# Altium project slave-14-mc33775.PrjPcb (part 2 of 2)
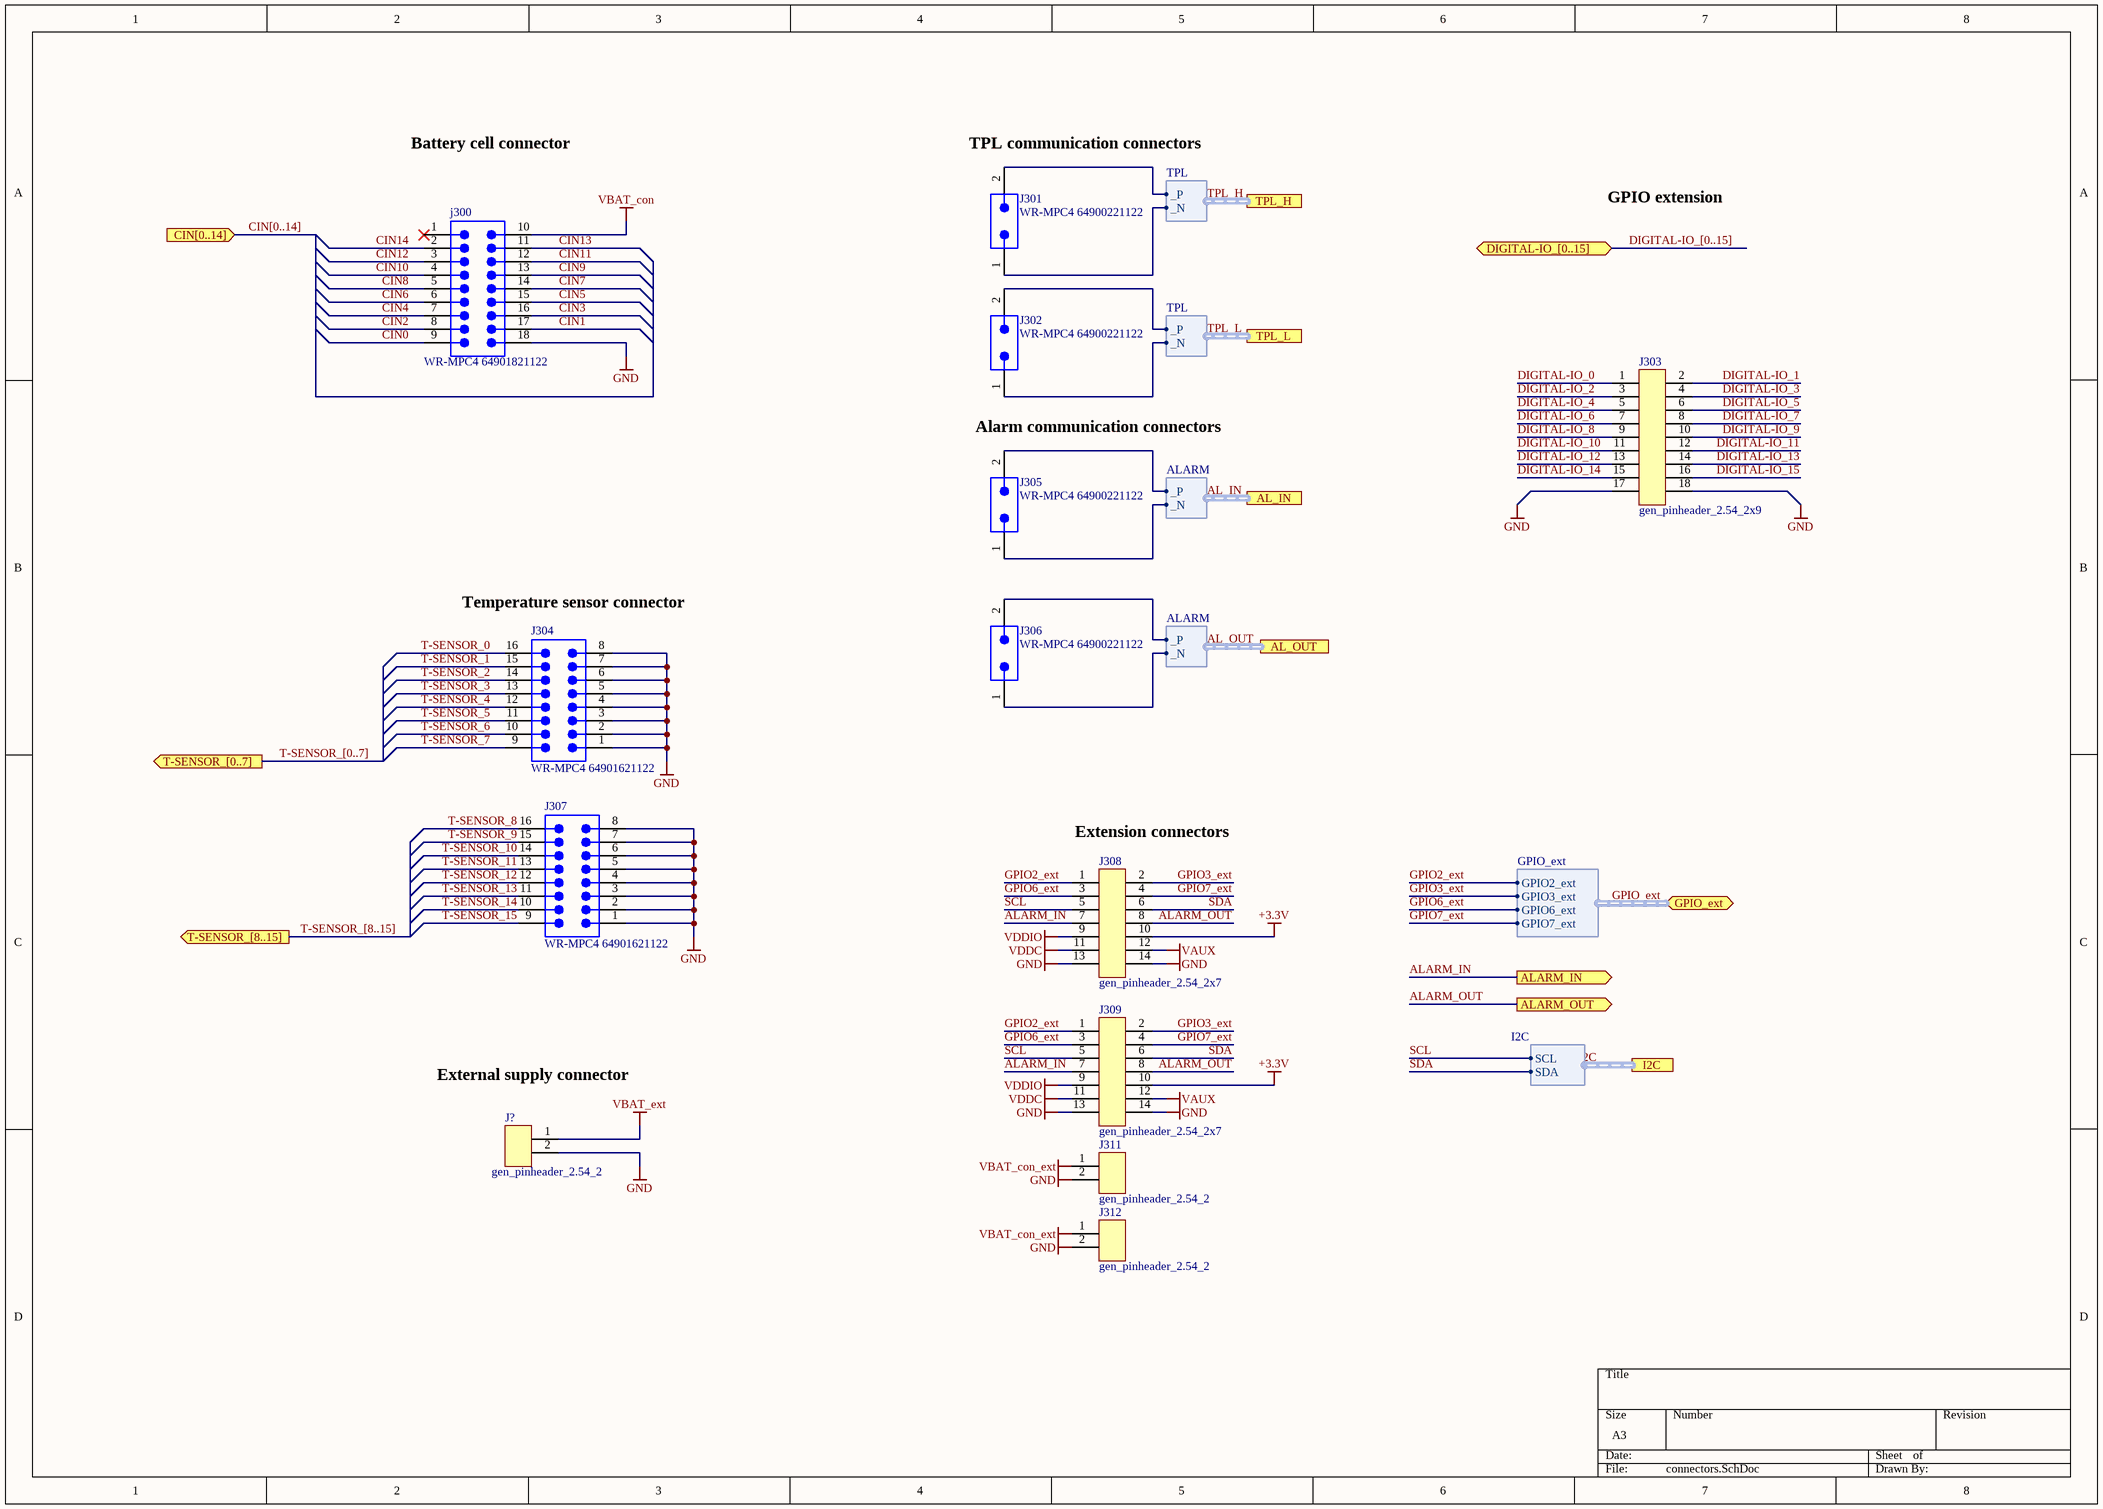
[diagram p8: connectors.SchDoc]

## Assembly variants
foxBMS_14cell_BMS-Slave_NXP775A_minimal: not fitted ALARM_IN C200_1 C200_2 C201_1 C201_2 C202_2 C203_1 C203_2 C204_2 C205_2 C206_2 C207_2 C208_2 C209_2 C210_2 C211_2 C212_2 C213_2 C214_2 C215_2 C216_2 C217_2 C218_2 C219_2 C220_1 C220_2 C221_1 C221_2 C400 C614 C615 C616 C617 C618 C800 C801 C802 C803 C804 C805 C806 C807 C808 C809 C810 C850 C851 C852 C900 C920 C921 C922 C923 C924 C925 D601 D608 D609 D610 IC920 L800 L801 LD800 LD850 Q601 Q602 R100 R200_2 R201_1 R201_2 R202_1 R202_2 R203_1 R203_2 R204_1 R204_2 R205_1 R205_2 R206_2 R207_2 R208_2 R209_2 R210_2 R211_2 R212_2 R213_2 R214_2 R215_2 R216_2 R217_2 R218_2 R219_2 R220_2 R221_2 R222_2 R223_2 R224_2 R225_2 R226_2 R227_2 R228_2 R229_2 R230_1 R230_2 R231_1 R231_2 R232_1 R232_2 R400 R401 R516 R517 R518 R519 R520 R521 R522 R523 R524 R525 R601 R603 R606 R607 R608 R609 R613 R614 R615 R616 R617 R620 R623 R624 R625 R626 R628 R632 R634 R638 R641 R642 R643 R706 R707 R708 R709 R710 R711 R712 R713 R800 R801 R802 R803 R804 R805 R806 R807 R808 R809 R810 R850 R851 R852 R853 R854 R900 R901 R902 R903 R904 R905 R906 R907 R908 R909 R910 R911 R912 R913 R914 R915 R916 R917 R918 R919 R920 R921 R922 R923 R924 R925 R926 R927 R928 R929 R930 R931 R932 R933 U200_1 U200_2 U201_1 U201_2 U202_1 U202_2 U400 U601 U800 U850 U851 U900 U920 U921 U922
foxBMS_14cell_BMS-Slave_NXP775A: not fitted C800 C801 C802 C803 C804 C805 C806 C807 C808 C809 C810 C920 C921 C923 C924 C925 IC920 L800 L801 LD800 R100 R200_2 R201_1 R202_1 R202_2 R203_1 R204_2 R210_1 R210_2 R211_1 R211_2 R212_1 R212_2 R213_1 R213_2 R214_1 R214_2 R215_1 R215_2 R216_1 R216_2 R217_1 R217_2 R230_1 R230_2 R516 R517 R518 R519 R520 R521 R522 R523 R524 R525 R603 R623 R624 R625 R626 R629 R630 R631 R633 R635 R636 R639 R640 R800 R801 R802 R803 R804 R805 R806 R807 R808 R809 R810 R850 R851 R853 R900 R901 R902 R904 R905 R906 R907 R908 R909 R910 R911 R912 R913 R914 R915 R917 R918 R919 R920 R921 R922 R923 R924 R925 R926 R927 R928 R929 R930 R931 R932 R933 U202_1 U202_2 U800 U850 U920 U922